# EAGLE design led_display_4x7_base_panel_for_AVR_v2_fill (EAGLE 5.10)
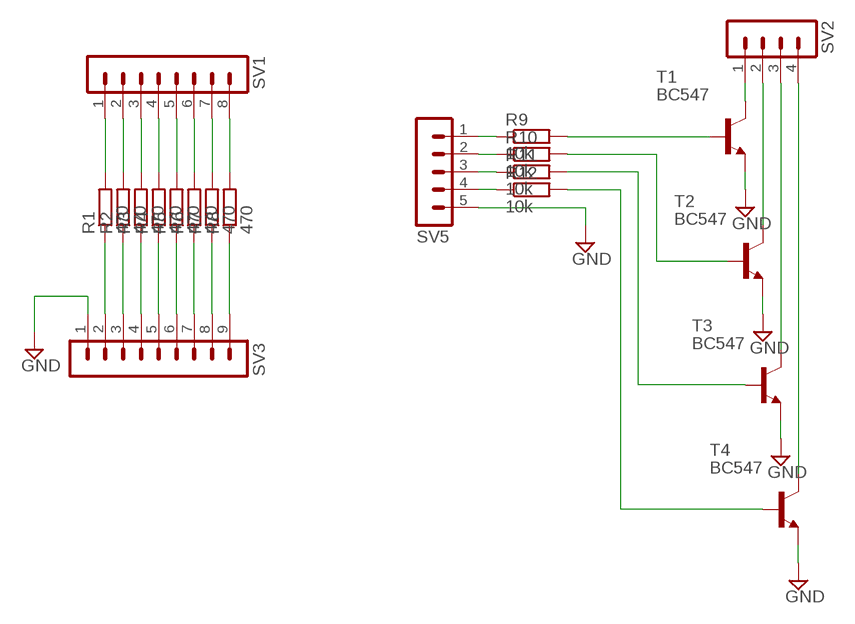
[diagram p0: schematic, sheet 1]

## Parts
R1  470  R-EU_0207/10  [0207/10]
R2  470  R-EU_0207/10  [0207/10]
R3  470  R-EU_0207/10  [0207/10]
R4  470  R-EU_0207/10  [0207/10]
R5  470  R-EU_0207/10  [0207/10]
R6  470  R-EU_0207/10  [0207/10]
R7  470  R-EU_0207/10  [0207/10]
R8  470  R-EU_0207/10  [0207/10]
R9  10k  R-EU_0207/10  [0207/10]
R10  10k  R-EU_0207/10  [0207/10]
R11  10k  R-EU_0207/10  [0207/10]
R12  10k  R-EU_0207/10  [0207/10]
SV1  MA08-1  [MA08-1]
SV2  MA04-1  [MA04-1]
SV3  MA09-1  [MA09-1]
SV5  MA05-1  [MA05-1]
T1  BC547  [TO92]
T2  BC547  [TO92]
T3  BC547  [TO92]
T4  BC547  [TO92]

## Nets
DIGIT_1_BASE: R9.2 T1.2(B)
DIGIT_1_IN: R9.1 SV5.1
DIGIT_1_N: SV2.1 T1.3(C)
DIGIT_2_BASE: R10.2 T2.2(B)
DIGIT_2_IN: R10.1 SV5.2
DIGIT_2_N: SV2.2 T2.3(C)
DIGIT_3_BASE: R11.2 T3.2(B)
DIGIT_3_IN: R11.1 SV5.3
DIGIT_3_N: SV2.3 T3.3(C)
DIGIT_4_BASE: R12.2 T4.2(B)
DIGIT_4_IN: R12.1 SV5.4
DIGIT_4_N: SV2.4 T4.3(C)
GND: SV3.1 SV5.5 T1.1(E) T2.1(E) T3.1(E) T4.1(E)
SEGMENT1: R1.2 SV1.1
SEGMENT1_1: R1.1 SV3.2
SEGMENT2: R2.2 SV1.2
SEGMENT2_1: R2.1 SV3.3
SEGMENT3: R3.2 SV1.3
SEGMENT3_1: R3.1 SV3.4
SEGMENT4: R4.2 SV1.4
SEGMENT4_1: R4.1 SV3.5
SEGMENT5: R5.2 SV1.5
SEGMENT5_1: R5.1 SV3.6
SEGMENT6: R6.2 SV1.6
SEGMENT6_1: R6.1 SV3.7
SEGMENT7: R7.2 SV1.7
SEGMENT7_1: R7.1 SV3.8
SEGMENT8: R8.2 SV1.8
SEGMENT8_1: R8.1 SV3.9

## Library data of the parts
R1-R12 = rcl:R-EU_: RESISTOR, European symbol
SV1 = con-lstb:MA08-1: PIN HEADER
SV2 = con-lstb:MA04-1: PIN HEADER
SV3 = con-lstb:MA09-1: PIN HEADER
SV5 = con-lstb:MA05-1: PIN HEADER
T1-T4 = transistor:BC547: NPN TRANSISTOR

## Board
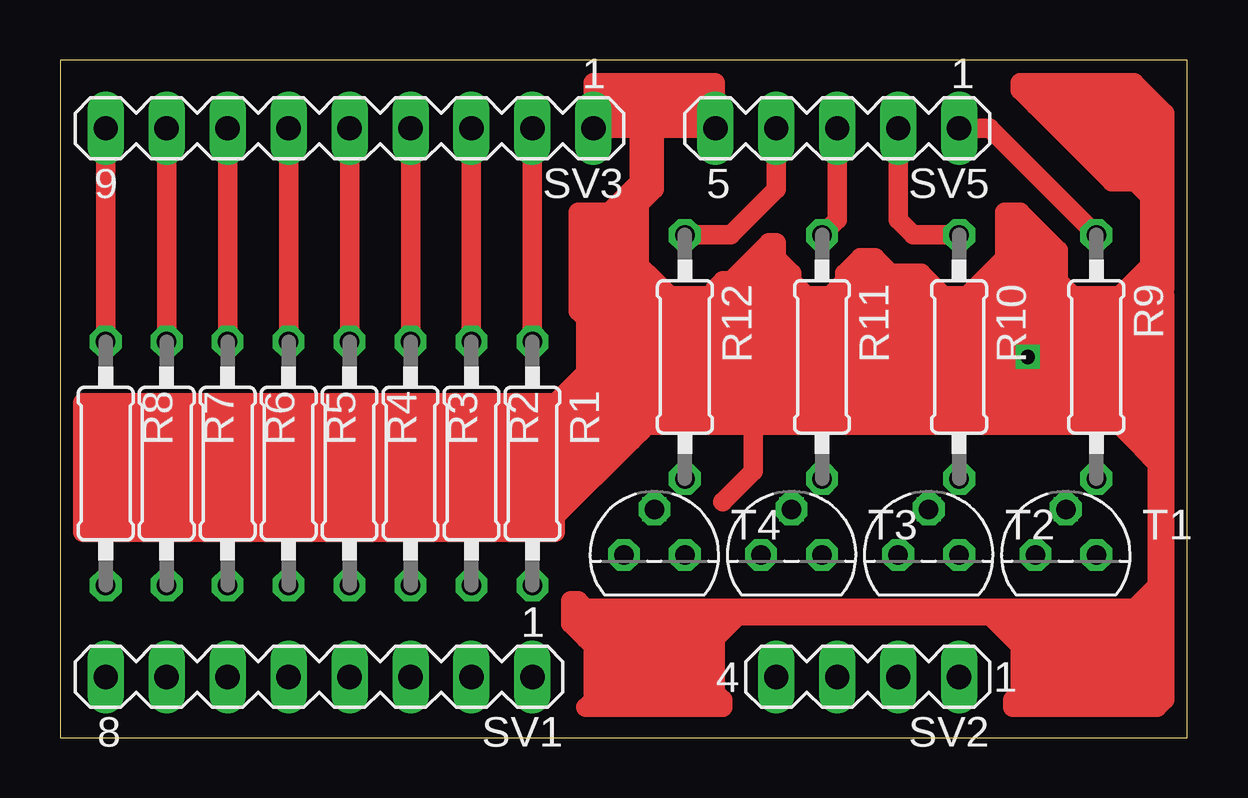
[diagram p1: board, top side]
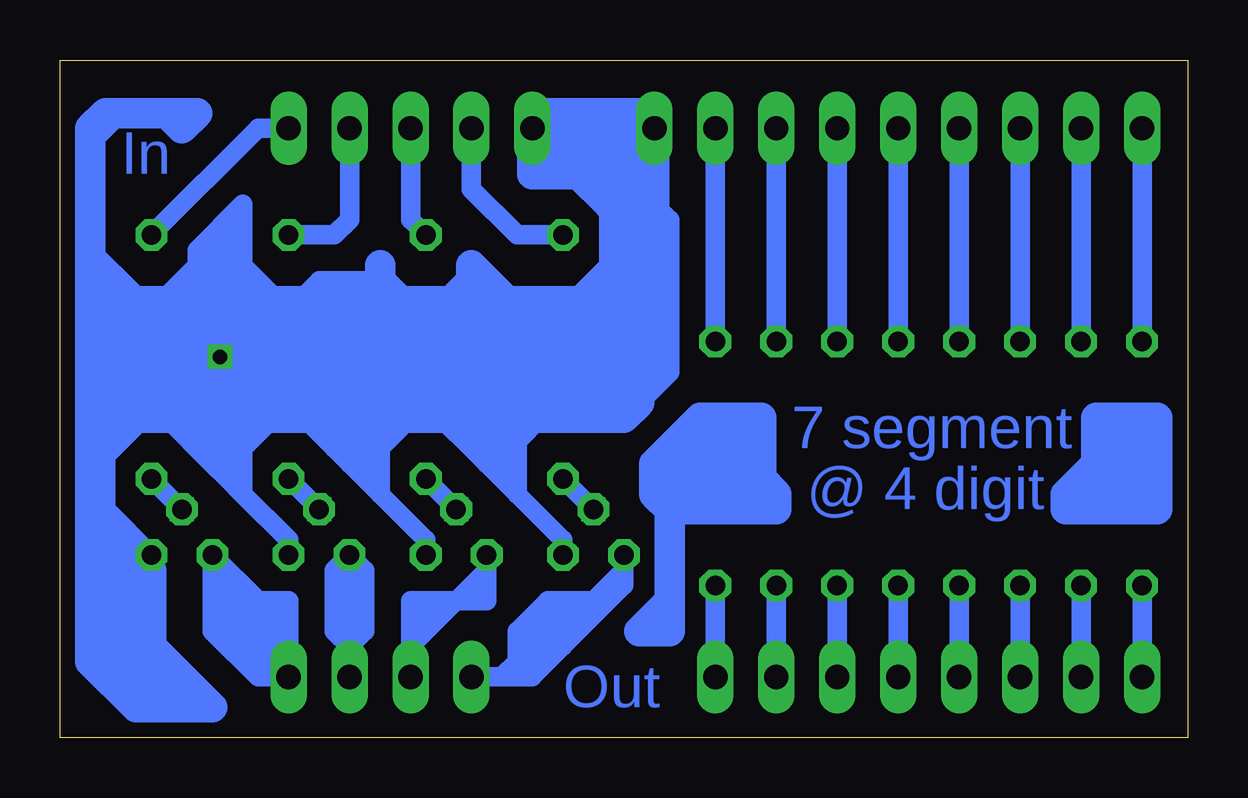
[diagram p2: board, bottom side, seen from below]

Size 46.97 x 28.25 mm. Coordinates in mm from the lower left corner, seen from the top.
Outline: 0,0 46.97,0 46.97,28.25 0,28.25 0,0
Copper layers (1*16): Top 0.035mm / dielectric 1.5mm / Bottom 0.035mm
Design rules "default": minimum track width 10mil, minimum drill 24mil, track to track 8mil, track to pad 8mil, pad to pad 8mil, via to via 8mil, smd to smd 8mil, copper to edge 40mil, drill to drill 8mil, minimum pad ring 10mil, minimum via ring 8mil, stop-mask expansion 4mil, vias tented up to drill 0mil, thermal gap 10mil

### Footprints (pad centres in the part's own frame; a part is rotated, then mirrored left to right if it is on the bottom)
0207/10 = drill 0.813 octagon: 1 -5.08,0; 2 5.08,0
MA08-1 = drill 1.016 long: 1 -8.89,0; 2 -6.35,0; 3 -3.81,0; 4 -1.27,0; 5 1.27,0; 6 3.81,0; 7 6.35,0; 8 8.89,0
MA04-1 = drill 1.016 long: 1 -3.81,0; 2 -1.27,0; 3 1.27,0; 4 3.81,0
MA09-1 = drill 1.016 long: 1 -10.16,0; 2 -7.62,0; 3 -5.08,0; 4 -2.54,0; 5 0,0; 6 2.54,0; 7 5.08,0; 8 7.62,0; 9 10.16,0
MA05-1 = drill 1.016 long: 1 -5.08,0; 2 -2.54,0; 3 0,0; 4 2.54,0; 5 5.08,0
TO92 = drill 0.813 octagon: 1 1.27,0; 2 0,1.905; 3 -1.27,0

### Placement (x,y rotation side)
R1  19.68,11.43 270 top
R2  17.14,11.43 270 top
R3  14.61,11.43 270 top
R4  12.06,11.43 270 top
R5  9.53,11.43 270 top
R6  6.99,11.43 270 top
R7  4.45,11.43 270 top
R8  1.91,11.43 270 top
R9  43.18,15.88 270 top
R10  37.47,15.88 270 top
R11  31.75,15.88 270 top
R12  26.04,15.88 270 top
SV1  10.79,2.54 180 top
SV2  33.66,2.54 180 top
SV3  12.06,25.4 180 top
SV5  32.38,25.4 180 top
T1  41.91,7.62 0 top
T2  36.2,7.62 0 top
T3  30.48,7.62 0 top
T4  24.77,7.62 0 top

### Tracks (layer width: path | path; a pad name or v marks a point on that pad's centre or on a via)
DIGIT_1_BASE  (via drill 0.6)
  Bottom 0.813: T1.2 R9.2
  other vias: 41.91,9.53
DIGIT_1_IN
  Top 0.813: SV5.1 38.73,25.4 R9.1
  Bottom 0.813: SV5.1 38.73,25.4 R9.1
DIGIT_1_N
  Bottom 0.813: T1.3 40.64,4.45 38.73,2.54 SV2.1 37.47,3.17 | 37.47,3.17 37.47,5.71 38.73,5.71 | 38.73,5.71 T1.3 | T1.3 40.64,6.99 39.37,5.71 38.73,5.71 | 38.73,5.71 38.1,5.08 38.1,3.17 38.73,3.17 40.01,4.45 40.01,5.08 | 40.01,5.71 40.01,5.08 | 40.01,5.08 38.73,3.81 38.73,5.08 39.37,5.08 37.47,3.17
DIGIT_2_BASE  (via drill 0.6)
  Bottom 0.813: T2.2 R10.2
  other vias: 36.2,9.53
DIGIT_2_IN
  Top 0.813: SV5.2 34.92,21.59 35.56,20.95 R10.1
  Bottom 0.813: R10.1 35.56,20.95 34.92,21.59 SV5.2
DIGIT_2_N
  Bottom 0.813: T2.3 34.92,3.81 | SV2.2 34.92,3.81 | 34.92,3.81 34.29,4.45 34.29,6.99 T2.3 | T2.3 35.56,6.99 35.56,4.45 34.92,3.81
DIGIT_3_BASE  (via drill 0.6)
  Bottom 0.813: T3.2 R11.2
  other vias: 30.48,9.53
DIGIT_3_IN
  Top 0.813: R11.1 32.38,21.59 SV5.3
  Bottom 0.813: R11.1 32.38,21.59 SV5.3
DIGIT_3_N
  Bottom 0.813: T3.3 29.21,6.99 | 30.48,5.71 29.21,5.71 29.21,6.99 | 30.48,5.71 31.75,5.71 | 31.75,5.71 32.38,5.71 32.38,5.08 | 32.38,5.08 32.38,4.45 | 32.38,3.81 SV2.3 | 32.38,3.81 30.48,5.71 | 32.38,3.81 32.38,4.45 | 32.38,4.45 31.75,5.08 | 31.75,5.08 31.75,5.71 | 31.75,5.71 32.38,5.08 | 32.38,5.08 31.75,5.08 | 29.21,6.99 30.48,5.71
DIGIT_4_BASE  (via drill 0.6)
  Bottom 0.813: T4.2 R12.2
  other vias: 24.77,9.53
DIGIT_4_IN
  Top 0.813: SV5.4 29.84,22.86 27.94,20.95 R12.1
  Bottom 0.813: R12.1 27.94,20.95 29.84,22.86 SV5.4
DIGIT_4_N
  Bottom 0.813: SV2.4 28.57,2.54 | 28.57,2.54 27.3,2.54 26.04,3.81 | 26.04,3.81 23.5,6.35 23.5,6.99 | 23.5,6.99 T4.3 | 23.5,6.99 24.77,5.71 | 24.77,5.71 25.4,5.08 25.4,5.71 | 25.4,5.71 24.77,5.71 | 25.4,5.71 26.67,5.71 27.94,4.45 27.94,3.17 28.57,2.54 | 27.3,3.81 26.04,3.81
  Bottom 1.27: 27.3,3.17 27.3,3.81 27.3,4.45 26.67,4.45 26.04,5.08 25.4,5.08
GND  (via drill 0.6)
  Top 0.813: 24.13,25.4 SV3.1 22.23,27.3 27.3,27.3 27.3,25.72 22.86,25.72 22.54,26.04 22.54,26.99 26.67,26.99 26.67,26.35 22.86,26.35 | 24.13,25.4 SV5.5 | 24.13,23.5 24.13,23.81 | 1.59,13.65 0.95,13.65 | 0.95,13.65 0.95,9.21 | 0.95,9.21 20.64,9.21 | 20.64,9.21 23.81,12.38 | 23.81,12.38 24.13,12.7 | 24.13,12.7 24.13,19.05 23.81,19.37 23.81,22.23 24.13,22.23 | 24.13,22.23 24.77,22.86 24.77,23.18 | 24.77,23.18 24.45,23.5 | 24.45,23.5 22.86,21.91 21.59,21.91 21.59,17.78 21.91,17.46 21.91,15.24 20.64,13.97 0.95,13.97 0.95,13.65 | 0.95,9.21 0.95,8.57 20.64,8.57 20.64,9.21 | 26.67,5.4 22.54,5.4 | 22.54,5.4 22.23,5.08 | 22.23,5.08 21.91,4.76 21.91,4.45 | 21.91,4.13 22.23,3.81 22.23,1.59 21.91,1.27 27.62,1.27 27.62,1.59 26.99,2.22 26.99,5.08 26.67,5.4 | 26.67,5.4 44.77,5.4 | 46.04,5.4 46.04,1.59 45.72,1.27 39.69,1.27 39.69,1.59 40.01,1.91 40.01,3.81 38.73,5.08 28.26,5.08 27.3,4.13 27.3,1.91 26.99,1.59 26.99,4.76 27.3,5.08 | 27.62,9.84 28.89,11.11 28.89,18.41 | 28.89,18.41 24.45,18.41 | 28.89,18.41 30.48,18.41 | 32.7,18.41 36.83,18.41 | 36.83,18.41 37.78,18.41 | 37.78,18.41 41.59,18.41 | 42.23,18.41 46.04,18.41 46.04,5.4 | 46.04,5.4 44.77,5.4 | 44.77,5.4 45.72,6.35 45.72,11.43 | 45.72,11.43 45.09,12.06 | 45.09,12.06 45.09,13.02 44.13,13.02 | 44.13,13.02 24.45,13.02 24.13,12.7 | 23.81,12.38 23.81,13.02 24.45,13.65 45.4,13.65 45.4,12.06 | 45.72,12.06 45.72,11.43 | 45.09,12.06 44.13,13.02 | 22.54,5.4 21.91,5.4 | 21.91,5.4 21.59,5.71 | 21.59,5.71 21.59,5.4 21.27,5.08 | 21.27,5.08 21.91,4.45 | 21.91,4.45 21.91,4.13 | 21.91,4.13 21.27,4.76 21.27,5.08 | 21.27,5.08 21.27,5.71 21.59,5.71 | 21.91,5.4 22.23,5.08 | 37.78,18.41 39.37,20 39.37,21.91 40.01,21.91 41.59,20.32 41.59,19.05 42.23,18.41
  Top 0.813: 42.23,18.41 41.59,18.41 | 41.59,18.41 40.64,19.37 40.64,19.68 40.96,20 | 40.96,19.37 40.96,20 | 40.96,20 39.69,21.27 39.69,20.32 40.01,20 40.01,19.37 40.32,19.05 39.05,19.05 | 38.73,19.05 39.05,19.05 | 39.05,19.05 39.69,19.68 | 36.83,18.41 35.88,19.37 34.61,19.37 33.97,20 33.34,20 32.7,19.37 32.7,18.73 33.97,18.73 | 35.56,18.73 33.97,18.73 | 33.97,18.73 33.34,19.37 33.66,19.37 | 33.97,19.37 33.66,19.37 | 33.66,19.37 32.7,18.41 | 32.7,18.41 32.07,18.41 | 32.07,18.41 31.11,18.41 | 31.11,18.41 30.48,18.41 | 30.48,18.41 30.48,19.05 | 30.48,19.05 30.48,19.37 29.84,20 29.84,20.64 29.53,20.64 27.94,19.05 27.62,19.05 27.3,18.73 29.84,18.73 29.84,19.37 29.53,19.37 29.21,19.68 28.57,19.05 | 30.16,19.37 30.48,19.05 | 30.48,19.05 31.11,18.41 | 31.11,18.41 31.11,17.78 | 33.02,19.05 32.7,19.05 32.07,18.41 | 20.64,13.02 22.54,14.92 22.54,17.78 22.23,18.1 22.23,21.27 22.54,21.59 23.5,21.59 23.5,20.32 | 23.5,20.32 23.5,13.02 20.64,10.16 20.64,11.11 22.86,13.34 22.86,14.29 | 22.86,21.27 22.86,14.29 | 22.86,14.29 20.64,12.06 | 25.4,18.1 25.4,18.41 23.5,20.32 | 23.5,20.32 23.81,20.32 24.13,20 | 24.13,20 24.13,19.37 | 24.13,20 24.13,22.23 | 24.13,22.23 22.54,20.64 | 24.13,25.4 24.13,23.81 | 24.13,23.81 24.45,23.5 | 24.77,23.18 24.77,25.08 | 24.13,23.81 24.13,22.86 23.81,22.54
  Bottom 0.813: SV5.5 SV3.1 22.23,22.23 | 22.23,16.51 22.23,21.59 22.23,22.23 | 22.23,16.51 22.86,15.88 29.21,15.88 | 29.21,15.88 34.92,15.88 | 34.92,15.88 v40.32,15.88 40.64,15.88 | 40.64,15.88 44.45,15.88 45.09,15.24 45.09,13.34 45.09,12.06 45.09,9.53 T1.1 | T2.1 37.47,8.26 39.37,10.16 | 40.64,11.43 40.01,10.79 | 40.64,15.88 40.64,12.7 | 40.64,12.06 40.64,11.43 | T3.1 31.75,8.26 33.66,10.16 | 34.92,11.43 33.66,10.16 | 34.92,15.88 34.92,12.06 | 34.92,12.06 34.92,11.43 | T4.1 26.04,8.26 27.94,10.16 | 27.94,10.16 29.21,11.43 | 29.21,11.43 29.21,15.88 | 28.57,11.43 27.94,12.06 | 27.94,12.06 27.94,10.16 | 27.94,12.06 27.94,12.7 29.84,12.7 30.48,13.34 30.48,12.7 | 30.48,12.7 29.21,11.43 | 30.48,12.7 31.11,13.34 | 34.92,11.43 36.83,13.34 36.2,13.34 34.92,12.06 | 34.92,12.06 35.56,12.06 37.47,13.97 40.01,11.43 40.01,10.79 | 40.01,10.79 39.37,10.16 | 39.37,12.7 39.37,10.16 | 40.64,11.43 42.55,13.34 41.91,13.34 40.64,12.06 | 40.64,12.06 40.64,12.7 | 40.64,12.7 41.27,13.34 | 33.66,10.16 33.66,12.06 32.38,13.34 23.5,13.34 21.59,15.24 21.59,21.59 22.23,22.23 | 22.23,16.51 22.23,15.24 | 34.29,19.05 36.2,19.05 37.47,17.78 38.1,18.41 | 38.73,17.78 38.1,18.41 | 23.5,18.41 25.4,18.41 | 25.4,18.41 24.13,19.68 | 23.5,20.32 24.13,19.68 | 24.13,19.68 24.13,22.23 | 38.1,18.41 39.37,19.05 39.37,19.68 | 39.37,19.68 39.37,22.23 41.27,20.32 41.27,19.68 | 41.27,19.68 41.27,19.05 | 41.91,18.41 43.81,18.41 | 43.81,18.41 45.09,18.41 45.72,20.32 43.81,18.41 | 45.72,24.77 44.45,26.04 | 38.1,18.41 25.4,18.41 | 38.1,18.41 39.37,19.68 | 39.37,19.68 40.64,19.68 | 42.55,17.78 42.55,18.41 41.27,19.68
  Bottom 1.27: 45.09,13.34 43.81,13.34 | 38.73,13.34 36.83,13.34 33.02,13.34 | 33.02,13.34 32.38,13.34 31.11,13.34 30.48,13.34 27.3,13.34 | 27.3,13.34 23.5,13.34 22.86,13.97 22.86,15.88 | 28.57,11.43 28.57,12.06 27.94,12.7 27.3,13.34 | 34.29,11.43 34.29,12.06 33.02,13.34 | 40.01,11.43 40.01,12.06 39.37,12.7 38.73,13.34 | 38.73,13.34 41.27,13.34 42.55,13.34 43.81,13.34 | 43.81,13.34 45.09,12.06 | SV3.1 22.23,26.04 26.67,26.04 | 26.67,26.04 26.67,25.4 27.3,24.77 22.86,24.77 SV3.1 | 27.3,23.5 25.4,23.5 24.13,22.23 23.5,21.59 | 23.5,21.59 23.5,20.32 23.5,19.05 | 23.5,19.05 23.5,18.41 23.5,17.14 24.77,17.14 | 23.5,19.05 24.77,17.78 29.84,17.78 | 29.84,17.78 31.11,17.78 | 31.11,17.78 32.38,17.78 | 32.38,17.78 33.66,17.78 | 33.66,17.78 34.92,17.78 | 34.92,17.78 37.47,17.78 38.73,17.78 | 45.72,15.88 43.81,17.78 42.55,17.78 | 45.72,15.88 45.72,8.26 | 45.72,4.45 43.81,2.54 42.55,2.54 | 42.55,2.54 42.55,3.17 | 42.55,3.17 43.18,3.81 43.18,5.71 | 43.18,5.71 45.09,7.62 | 45.09,7.62 45.09,6.35 43.81,5.08 43.81,3.81 | 43.81,3.17 43.81,3.81 | 43.81,3.81 45.09,5.08 | 45.09,7.62 45.72,8.26 | 45.72,8.26 45.72,4.45 | 29.84,17.78 29.84,19.05 | 29.84,19.05 29.84,19.68 27.3,17.14 | 29.84,19.05 31.11,17.78 | 33.66,19.68 33.66,19.05 | 33.66,19.05 33.66,17.78 | 32.38,17.78 33.66,19.05 | 33.66,19.05 34.92,17.78 | 34.92,17.78 34.92,16.51 33.66,15.24 | 38.73,17.78 40.01,17.78 | 40.01,17.78 41.27,17.78 | 38.73,17.78 39.37,19.05 40.01,20.32 | 40.01,20.95 40.01,20.32 | 40.01,20.32 40.64,19.68 41.27,19.05 41.91,18.41 42.55,17.78 | 42.55,17.78 41.27,17.78 | 41.27,17.78 40.01,19.05 40.01,17.78 | 45.09,8.89 43.18,6.99 43.18,5.71 | 42.55,2.54 41.91,2.54 | 41.91,2.54 40.64,1.27 43.81,1.27 45.72,3.17 45.72,4.45
  Bottom 1.27: 42.55,3.17 41.91,2.54 | 43.81,16.51 23.5,16.51 22.86,17.14 22.86,23.5 24.13,23.5 | 24.77,23.5 24.13,23.5 | 24.13,23.5 23.5,22.86 23.5,21.59 | 42.55,26.04 41.27,26.04 41.91,25.4 42.55,26.04 | 42.55,26.04 44.45,26.04 45.09,26.04 45.72,25.4 45.72,24.77 45.72,20.32 45.72,16.51 | 45.72,15.88 45.72,16.51 | 45.72,16.51 44.45,17.78 | 24.13,24.13 26.67,24.13 27.3,23.5 | 27.3,23.5 27.3,26.04 26.67,26.04 | SV3.1 22.23,21.59
N$4
  Bottom 1.27: 2.54,13.34 3.81,13.34 3.81,11.43 5.08,10.16 5.08,9.53 1.27,9.53 1.27,13.34 2.54,13.34 | 2.54,13.34 3.17,12.7 3.17,10.79 3.81,10.16 2.54,10.16 1.91,10.79 1.91,12.7
N$5
  Bottom 1.27: 21.59,9.53 22.23,10.16 22.23,11.43 20.32,13.34 17.78,13.34 17.78,10.79 | 21.59,9.53 17.14,9.53 17.14,10.16 17.78,10.79 | 17.78,10.79 18.41,10.16 21.59,10.16 21.59,10.79 19.68,12.7 18.41,12.7 18.41,10.79 20.32,10.79 19.05,12.06 | 21.59,9.53 21.59,5.71 | 21.59,5.71 21.59,4.45 22.86,4.45 21.59,5.71
N$6
  Top 0.813: 22.54,1.59 22.54,4.76 26.35,4.76 26.35,2.22 26.67,1.91 22.86,1.91 22.86,3.81 23.18,4.13 25.72,4.13 25.72,2.54 23.5,2.54 23.5,3.49 25.08,3.49 25.08,3.17 23.81,3.17
N$7
  Top 0.813: 39.37,5.08 39.69,5.08 40.64,4.13 40.64,2.22 40.32,1.91 45.4,1.91 45.4,4.76 40.64,4.76 41.27,4.13 41.27,2.54 44.45,2.54 44.77,2.86 | 44.77,2.86 44.77,2.54 | 44.77,2.86 44.77,4.45 42.23,4.45 41.91,4.13 41.91,3.17 44.13,3.17 44.13,3.81 42.23,3.81
N$9
  Top 0.813: 40.96,26.35 41.59,26.35 45.72,22.23 45.72,20 45.4,19.68 | 45.4,19.68 43.5,17.78 44.13,17.78 46.04,19.68 | 46.04,19.68 46.04,18.73 | 46.04,19.68 46.04,26.04 44.77,27.3 40.01,27.3 40.01,26.99 40.64,26.35 | 40.64,26.67 40.64,26.35 | 40.64,26.35 43.81,23.18 45.4,23.18 45.4,26.04 44.45,26.99 41.59,26.99 41.27,26.67 42.23,26.67 45.09,23.81 45.09,24.77 43.18,26.67 43.81,26.67 44.77,25.72 | 45.4,19.68 45.4,22.86 | 45.4,19.68 45.4,18.1
SEGMENT1
  Bottom 0.813: SV1.1 R1.2
SEGMENT1_1
  Top 0.813: R1.1 SV3.2
  Bottom 0.813: R1.1 SV3.2
SEGMENT2
  Bottom 0.813: R2.2 SV1.2
SEGMENT2_1
  Top 0.813: R2.1 SV3.3
  Bottom 0.813: SV3.3 R2.1
SEGMENT3
  Bottom 0.813: SV1.3 R3.2
SEGMENT3_1
  Top 0.813: R3.1 SV3.4
  Bottom 0.813: SV3.4 R3.1
SEGMENT4
  Bottom 0.813: SV1.4 R4.2
SEGMENT4_1
  Top 0.813: R4.1 SV3.5
  Bottom 0.813: SV3.5 R4.1
SEGMENT5
  Bottom 0.813: SV1.5 R5.2
SEGMENT5_1
  Top 0.813: R5.1 SV3.6
  Bottom 0.813: SV3.6 R5.1
SEGMENT6
  Bottom 0.813: SV1.6 R6.2
SEGMENT6_1
  Top 0.813: R6.1 SV3.7
  Bottom 0.813: SV3.7 R6.1
SEGMENT7
  Bottom 0.813: SV1.7 R7.2
SEGMENT7_1
  Top 0.813: R7.1 SV3.8
  Bottom 0.813: SV3.8 R7.1
SEGMENT8
  Bottom 0.813: SV1.8 R8.2
SEGMENT8_1
  Top 0.813: R8.1 SV3.9
  Bottom 0.813: SV3.9 R8.1
(copper drawn outside any net)
  shapes: Bottom area x1, Top area x3

### Text on the board
Bottom: In | 7 segment | @ 4 digit | Out